# EasyEDA Pro project CH32V203C8T6采样整合板.eprj

# Board PCB
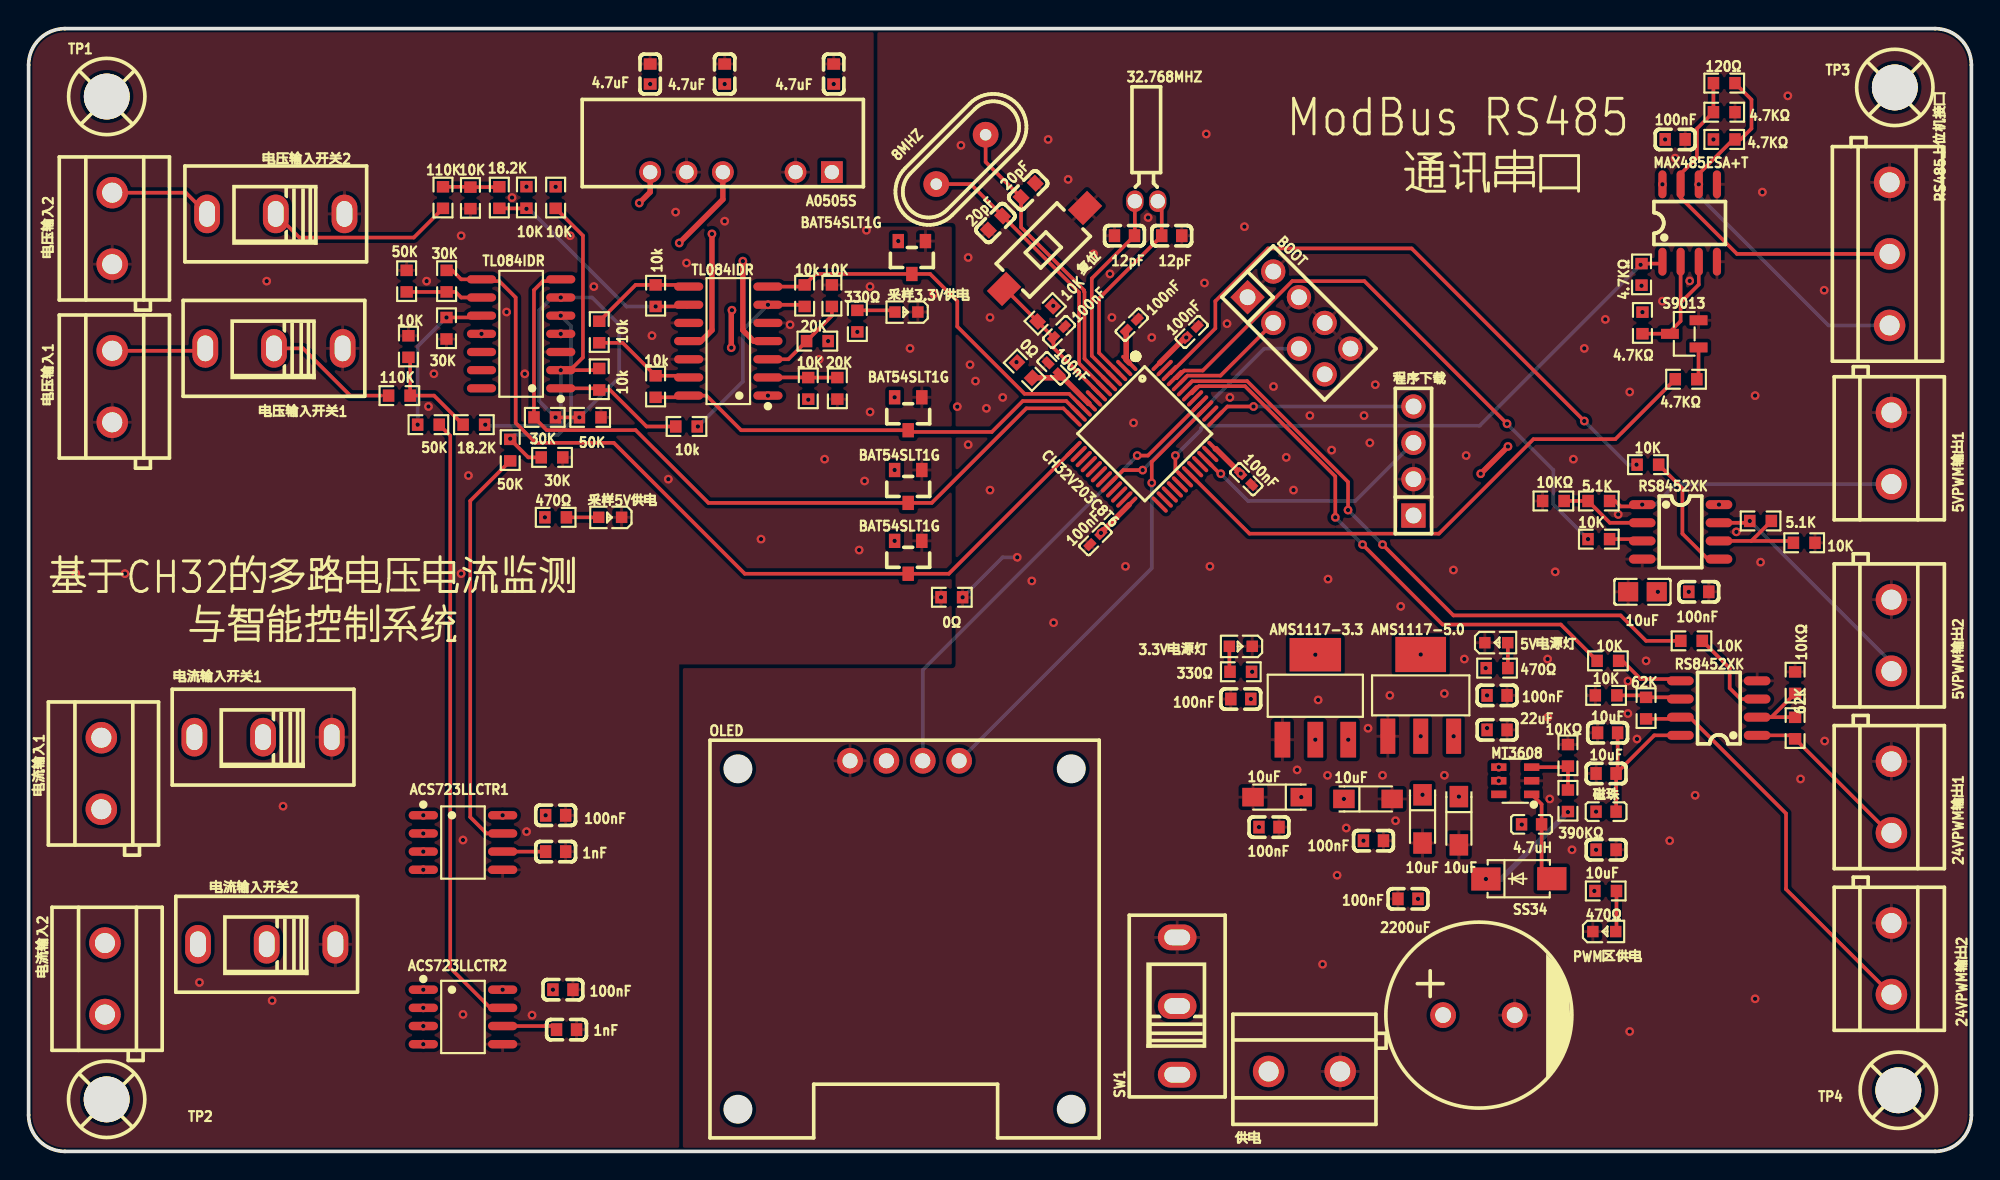
[diagram p0: board, top side]
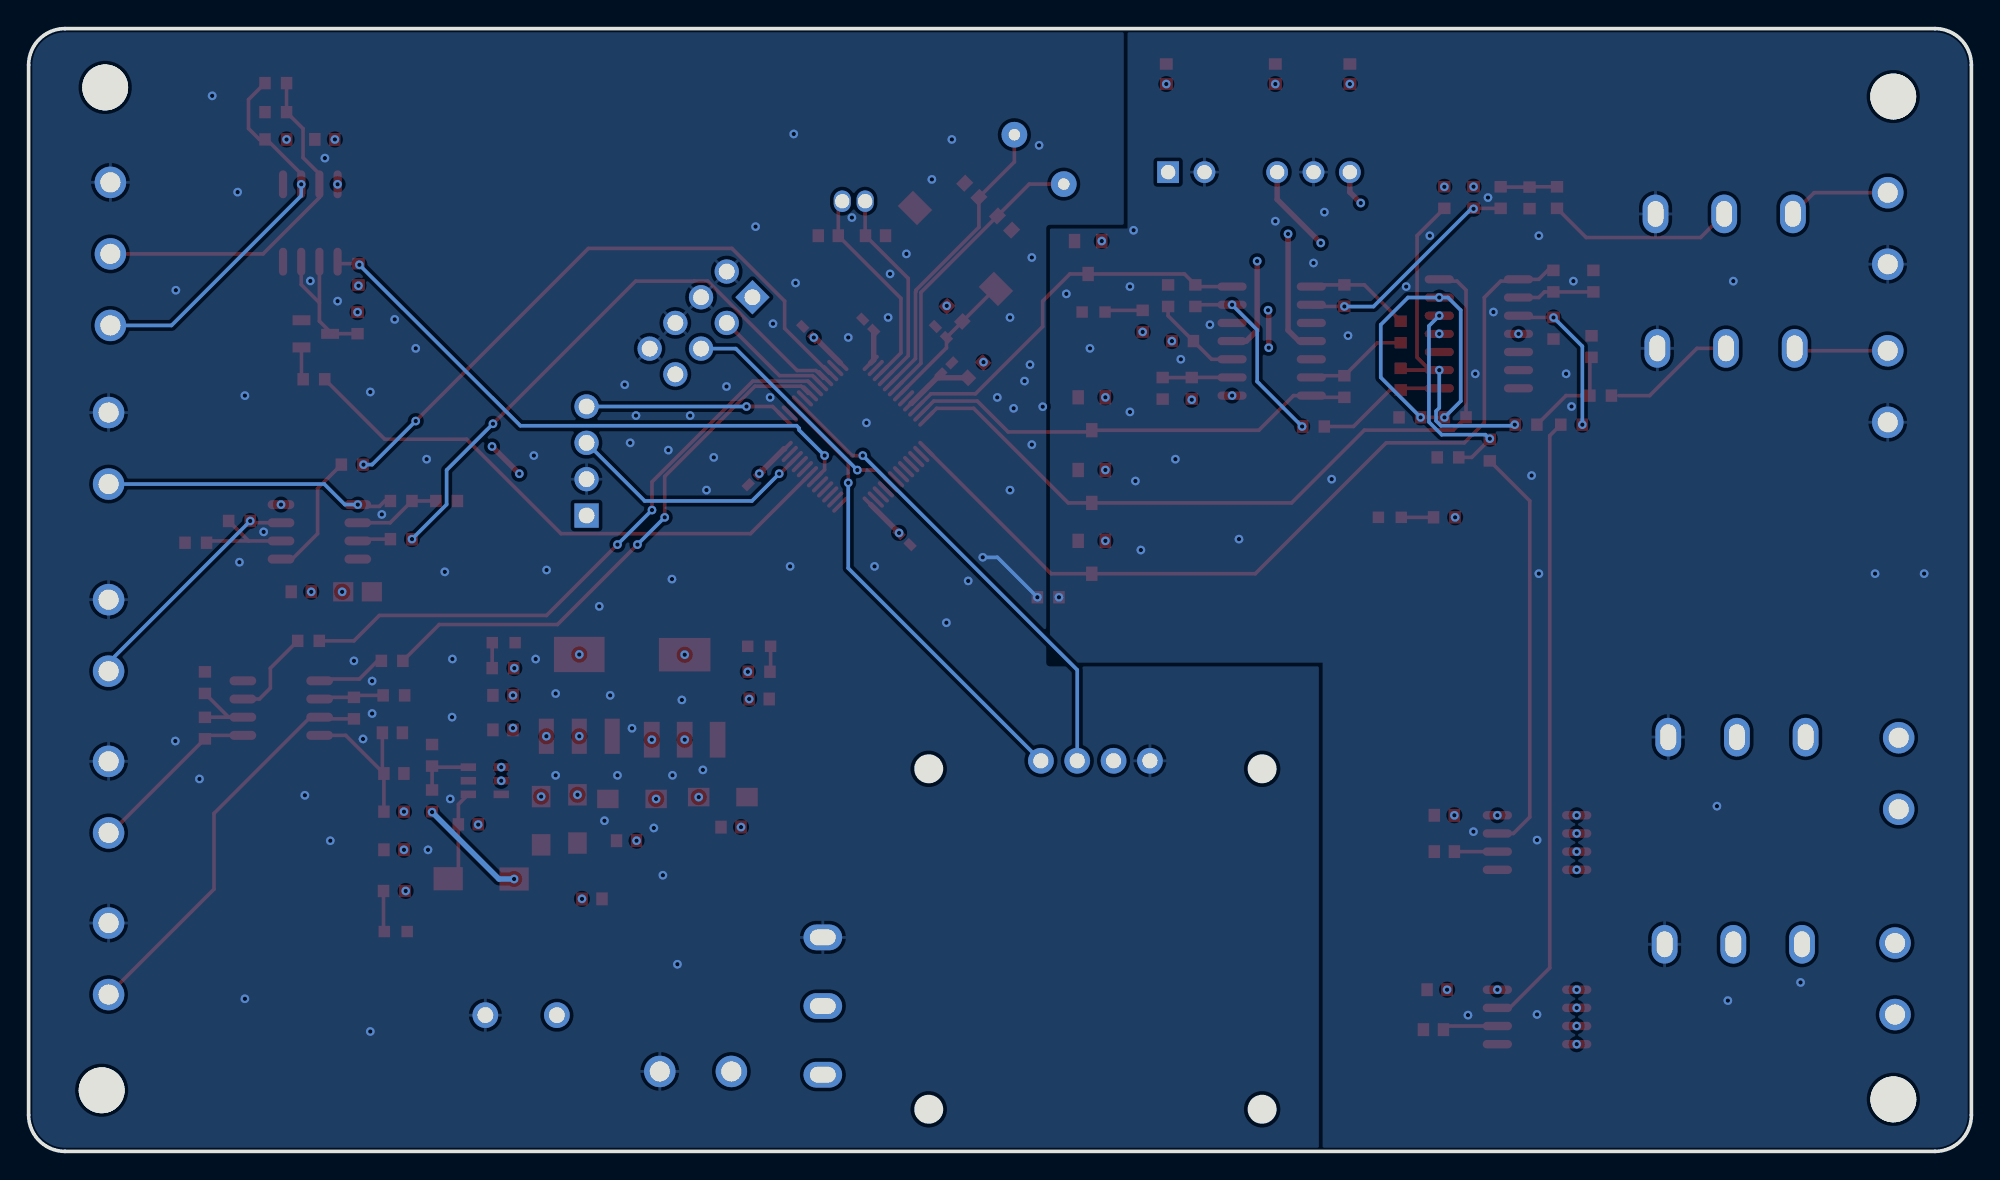
[diagram p1: board, bottom side, seen from below]

Outline 135.76 x 78.49 mm; copper layers: Top Layer, 电源层, GND, Bottom Layer. Coordinates in mm from the lower left corner of the outline.
Outline path: 0,75.95 0,2.54 arc(0.74,0.74) 2.54,0 133.22,0 arc(135.02,0.74) 135.76,2.54 135.76,75.95 arc(135.02,77.74) 133.22,78.49 2.54,78.49 arc(0.74,77.74) 0,75.95
Stack: Top Layer 0.035mm 外层铜厚1oz / Dielectric1 0.2104mm 7628 RC49% 8.6mil / 电源层 0.0152mm 内层铜厚 / Dielectric2 1.065mm 1.1mm H/HOZ Copper / GND 0.0152mm 内层铜厚 / Dielectric3 0.2104mm 7628 RC49% 8.6mil / Bottom Layer 0.035mm 外层铜厚1oz

## Design rules (mm)
template: JLCPCB Capability(Two Layers Board)
spacing copperThickness1oz (default): track to track 0.102, other pairs 0.152 to 0.3
spacing copperThickness2oz: track to track 0.203, other pairs 0.152 to 0.3
track width copperThickness1oz (default): min 0.127, default 0.254, max 2.54
track width copperThickness2oz: min 0.203, default 0.254, max 2.54
differential pair differentialPair (default): width min 0.127, default 0.254, max 2.54; gap min 0.152, default 0.152
via viaSize (default): diameter min 0.5, default 0.61, max 10; hole min 0.3, default 0.305, max 6.3

## Placement (name value [footprint] x y rotation side)
0Ω  -  [R0603]  69.6 54.61 315 top
0Ω#2  -  [R0603]  64.52 38.73 180 top
1nF  -  [C0603]  36.83 20.95 180 top
1nF#2  -  [C0603]  37.59 8.51 180 top
3.3V电源灯  LTST-C190KSKT  [LED0603-RD]  84.71 35.31 180 top
4.7KΩ  -  [R0603]  112.71 61.31 270 top
4.7KΩ#2  -  [R0603]  118.49 70.74 0 top
4.7KΩ#3  -  [R0603]  118.49 72.64 0 top
4.7KΩ#4  -  [R0603]  115.82 53.97 180 top
4.7KΩ#5  -  [R0603]  112.78 57.91 90 top
4.7uF  -  [C0603]  56.26 75.31 270 top
4.7uF#2  -  [C0603]  43.43 75.31 90 top
4.7uF#3  -  [C0603]  48.64 75.31 270 top
4.7uH  4.7uH  [L0603]  105.03 22.86 180 top
5.1K  -  [R0603]  109.73 45.47 0 top
5.1K#2  -  [R0603]  121.03 44.07 0 top
5VPWM输出1  KF301-5.0-2P  [CONN-TH_P5.00_KF301-5.0-2P]  130.17 49.15 90 top
5VPWM输出2  KF301-5.0-2P  [CONN-TH_P5.00_KF301-5.0-2P]  130.17 36.07 90 top
5V电源灯  LTST-C190KSKT  [LED0603-RD]  102.56 35.56 0 top
8MHZ  8MHz  [HC-49US_L11.0-W4.6-P4.88]  65.15 69.34 225 top
10K  -  [R0603]  109.73 42.8 0 top
10k  -  [R0603]  39.88 53.97 90 top
10K#2  -  [R0603]  113.16 48.01 180 top
10k#2  -  [R0603]  45.97 50.67 180 top
10K#3  -  [R0603]  124.08 42.55 180 top
10k#3  -  [R0603]  54.23 59.82 270 top
10K#4  -  [R0603]  116.2 35.69 0 top
10k#4  -  [R0603]  39.88 57.28 90 top
10K#5  -  [R0603]  110.36 34.29 180 top
10k#5  -  [R0603]  43.81 53.47 90 top
10K#6  -  [R0603]  110.24 31.88 0 top
10k#6  -  [R0603]  43.81 59.82 270 top
10K#7  -  [R0603]  56.13 59.82 90 top
10K#8  -  [R0603]  54.48 53.34 90 top
10K#9  -  [R0603]  26.54 56.26 90 top
10K#10  -  [R0603]  36.83 66.67 90 top
10K#11  -  [R0603]  30.88 66.65 270 top
10K#12  -  [R0603]  34.79 66.68 90 top
10K#13  -  [R0603]  71.04 58.55 225 top
10KΩ  -  [R0603]  106.55 45.47 0 top
10KΩ#2  -  [R0603]  107.57 27.69 270 top
10KΩ#3  -  [R0603]  123.44 32.77 270 top
10uF  -  [CAP-SMD_L3.2-W1.6-RD]  87.25 24.77 180 top
10uF#2  -  [CAP-SMD_L3.2-W1.6-RD]  93.6 24.64 0 top
10uF#3  -  [CAP-SMD_L3.2-W1.6-RD]  99.95 23.11 270 top
10uF#4  -  [CAP-SMD_L3.2-W1.6-RD]  97.41 23.24 270 top
10uF#5  -  [C0805]  112.78 39.12 0 top
10uF#6  -  [C0603]  110.34 29.26 0 top
10uF#7  -  [C0603]  110.24 26.42 0 top
10uF#8  -  [C0603]  110.24 21.08 0 top
12pF  -  [C0603]  79.88 64.01 180 top
12pF#2  -  [C0603]  76.58 64.01 0 top
18.2K  -  [R0603]  31.11 50.8 0 top
18.2K#2  -  [R0603]  32.89 66.67 270 top
20K  -  [R0603]  56.51 53.34 90 top
20K#2  -  [R0603]  55.12 56.64 180 top
20pF  -  [C0603]  69.85 67.18 225 top
20pF#2  -  [C0603]  67.56 64.9 45 top
22uF  22uF  [C0603]  102.62 29.46 180 top
24VPWM输出1  KF301-5.0-2P  [CONN-TH_P5.00_KF301-5.0-2P]  130.17 24.77 90 top
24VPWM输出2  KF301-5.0-2P  [CONN-TH_P5.00_KF301-5.0-2P]  130.17 13.46 90 top
30K  -  [R0603]  36.58 48.51 180 top
30K#2  -  [R0603]  36.07 51.31 0 top
30K#3  -  [R0603]  29.2 57.54 90 top
30K#4  -  [R0603]  29.21 60.83 270 top
32.768MHZ  32.768kHz  [OSC-TH_BD2.0-P0.50]  78.1 66.42 0 top
50K  -  [R0603]  39.24 51.31 180 top
50K#2  -  [R0603]  33.66 49.02 90 top
50K#3  -  [R0603]  26.42 60.83 270 top
50K#4  -  [R0603]  27.94 50.8 180 top
62K  -  [R0603]  123.44 29.59 270 top
62K#2  -  [R0603]  113.03 30.99 90 top
100nF  -  [C0402]  77.09 57.78 225 top
100nF#2  -  [C0402]  71.63 54.74 315 top
100nF#3  -  [C0402]  85.09 46.99 315 top
100nF#4  -  [C0402]  74.55 42.8 45 top
100nF#5  -  [C0402]  81.28 57.28 45 top
100nF#6  -  [C0402]  72.01 57.28 45 top
100nF#7  -  [C0603]  36.83 23.49 180 top
100nF#8  -  [C0603]  37.34 11.3 180 top
100nF#9  -  [C0603]  115.06 70.74 0 top
100nF#10  -  [C0603]  86.68 22.67 180 top
100nF#11  -  [C0603]  84.71 31.62 0 top
100nF#12  -  [C0603]  93.98 21.72 180 top
100nF#13  -  [C0603]  102.62 31.88 180 top
100nF#14  -  [C0603]  116.71 39.12 180 top
100nF#15  -  [C0603]  96.39 17.65 0 top
110K  -  [R0603]  25.91 52.83 0 top
110K#2  -  [R0603]  28.96 66.67 90 top
120Ω  120Ω  [R0603]  118.49 74.68 180 top
330Ω  -  [R0603]  84.71 33.53 180 top
330Ω#2  -  [R0603]  57.91 58.04 270 top
390KΩ  390kΩ  [R0603]  107.57 24.51 270 top
470Ω  -  [R0603]  102.62 33.78 0 top
470Ω#2  -  [R0603]  36.83 44.32 180 top
470Ω#3  -  [R0603]  110.21 18.2 180 top
2200uF  2200uF  [CAP-TH_BD13.0-P5.00-D0.6-FD]  101.35 9.53 0 top
A0505S  A0505S-1WR3  [PWRM-TH_5P-L19.7-W6.0-P2.54_DEXU_A0515S-1WR3]  49.78 68.45 180 top
ACS723LLCTR1  ACS723LLCTR-05AB-T  [SOIC-8_L4.9-W3.9-P1.27-LS6.0-BL]  30.35 21.59 270 top
ACS723LLCTR2  ACS723LLCTR-05AB-T  [SOIC-8_L4.9-W3.9-P1.27-LS6.0-BL]  30.35 9.4 270 top
AMS1117-3.3  AMS1117-3.3  [SOT-223-3_L6.5-W3.4-P2.30-LS7.0-BR]  89.92 31.75 270 top
AMS1117-5.0  AMS1117-5.0  [SOT-223_L6.5-W3.5-P2.30-LS7.0-BR]  97.28 31.88 270 top
BAT54SLT1G  -  [SOT-23_L2.9-W1.3-P1.90-LS2.4-BR]  61.72 62.48 90 top
BAT54SLT1G#2  -  [SOT-23_L2.9-W1.3-P1.90-LS2.4-BR]  61.47 51.56 90 top
BAT54SLT1G#3  -  [SOT-23_L2.9-W1.3-P1.90-LS2.4-BR]  61.47 46.48 90 top
BAT54SLT1G#4  -  [SOT-23_L2.9-W1.3-P1.90-LS2.4-BR]  61.47 41.53 90 top
BOOT  PZ254V-12-8P  [HDR-TH_8P-P2.54-V-M-R2-C4-S2.54]  88.77 57.91 315 top
CH32V203C8T6  CH32V203C8T6  [LQFP-48_L7.0-W7.0-P0.50-LS9.0-BL]  77.98 50.16 225 top
MAX485ESA+T  MAX485ESA+T  [SOIC-8_L5.0-W4.0-P1.27-LS6.0-BL]  116.08 64.9 0 top
MT3608  MT3608  [SOT-23-6_L2.9-W1.6-P0.95-LS2.8-BL]  103.89 25.91 90 top
OLED  HS96L03W2C03  [OLED-TH_L27.8-W27.2-P2.54_C9900033791]  61.21 27.3 0 top
PWM区供电  LTST-C190KSKT  [LED0603-RD]  110.11 15.37 0 top
RS485上位机接口  KF301-5.0-3P  [CONN-TH_3P-P5.00_KF301-5.0-3P]  130.05 62.74 90 top
RS8452XK  -  [SOP-8_L4.9-W3.9-P1.27-LS6.0-BL]  115.44 43.31 270 top
RS8452XK#2  -  [SOP-8_L4.9-W3.9-P1.27-LS6.0-BL]  118.11 30.99 90 top
S9013  S9013 J3(RANGE:200-350)  [SOT-23-3_L2.9-W1.3-P1.90-LS2.4-BR]  115.7 57.15 0 top
SS34  SS34  [SMA_L4.3-W2.6-LS5.0-FD]  104.14 19.05 180 top
SW1  SS-12D10G6-G  [SW-TH_SS-12D10G4-G]  80.26 10.16 90 top
TL084IDR  -  [SOIC-14_L8.7-W3.9-P1.27-LS6.0-BL]  48.89 56.64 90 top
TL084IDR#2  -  [SOIC-14_L8.7-W3.9-P1.27-LS6.0-BL]  34.42 57.15 90 top
TP1  -  [M3螺丝]  5.52 73.68 0 top
TP2  -  [M3螺丝]  5.52 3.57 0 top
TP3  -  [M3螺丝]  130.48 74.31 0 top
TP4  -  [M3螺丝]  130.72 4.21 0 top
供电  KF301-5.0-2P  [CONN-TH_P5.00_KF301-5.0-2P]  89.15 5.59 0 top
复位  TS-1101-C-W  [SW-SMD_L6.0-W3.3-LS8.0]  70.99 63.12 45 top
电压输入1  KF301-5.0-2P  [CONN-TH_P5.00_KF301-5.0-2P]  5.84 53.47 270 top
电压输入2  KF301-5.0-2P  [CONN-TH_P5.00_KF301-5.0-2P]  5.84 64.52 270 top
电压输入开关1  SS-12D10G6-G  [SW-TH_SS-12D10G4-G]  17.14 56.13 180 top
电压输入开关2  SS-12D10G6-G  [SW-TH_SS-12D10G4-G]  17.27 65.53 180 top
电流输入1  KF301-5.0-2P  [CONN-TH_P5.00_KF301-5.0-2P]  5.08 26.42 270 top
电流输入2  KF301-5.0-2P  [CONN-TH_P5.00_KF301-5.0-2P]  5.33 12.06 270 top
电流输入开关1  SS-12D10G6-G  [SW-TH_SS-12D10G4-G]  16.38 28.96 180 top
电流输入开关2  SS-12D10G6-G  [SW-TH_SS-12D10G4-G]  16.64 14.48 180 top
磁珠  GZ1608D601TF  [L0603]  110.24 23.75 180 top
程序下载  PZ254V-11-04P  [HDR-TH_4P-P2.54-V-M]  96.77 48.26 90 top
采样3.3V供电  LTST-C190KSKT  [LED0603-RD]  61.34 58.67 180 top
采样5V供电  LTST-C190KSKT  [LED0603-RD]  40.64 44.32 180 top

## Footprints (pads in the part's own frame, mm; a bottom-side part is the same pattern mirrored in y, then rotated)
C0402
  rect 0.79x0.54 smd: 1(-0.545,0) 2(0.545,0)
C0603
  rect 0.8x0.9 smd: 1(-0.7,0) 2(0.7,0)
C0805
  rect 1.41x1.35 smd: 1(-1,0) 2(1,0)
CAP-SMD_L3.2-W1.6-RD
  rect 1.5x1.296 smd: 1(-1.687,0) 2(1.687,0)
CAP-TH_BD13.0-P5.00-D0.6-FD
  round 1.8 hole 1.1: 1(-2.5,0) 2(2.5,0)
CONN-TH_3P-P5.00_KF301-5.0-3P
  round 2.2 hole 1.4: 1(-5,0) 2(0,0) 3(5,0)
CONN-TH_P5.00_KF301-5.0-2P
  round 2.2 hole 1.4: 1(-2.5,0) 2(2.5,0)
HC-49US_L11.0-W4.6-P4.88
  round 1.8 hole 0.8: 1(-2.44,0) 2(2.44,0)
HDR-TH_4P-P2.54-V-M
  rect 1.7x1.7 hole 1.1: 1(-3.81,0)
  round 1.7 hole 1.1: 2(-1.27,0) 3(1.27,0) 4(3.81,0)
HDR-TH_8P-P2.54-V-M-R2-C4-S2.54
  rect 1.7x1.7 hole 1.1: 1(-3.81,-1.27)
  round 1.7 hole 1.1: 2(-3.81,1.27) 3(-1.27,-1.27) 4(-1.27,1.27) 5(1.27,-1.27) 6(1.27,1.27) 7(3.81,-1.27) 8(3.81,1.27)
L0603
  rect 0.8x0.864 smd: 1(-0.7,0) 2(0.7,0)
LED0603-RD
  rect 0.8x0.8 smd: 1(-0.799,0) 2(0.799,0)
LQFP-48_L7.0-W7.0-P0.50-LS9.0-BL
  oval 0.27x1.5 smd: 1(-2.75,-4.25) 2(-2.25,-4.25) 3(-1.75,-4.25) 4(-1.25,-4.25) 5(-0.75,-4.25) 6(-0.25,-4.25) 7(0.25,-4.25) 8(0.75,-4.25) 9(1.25,-4.25) 10(1.75,-4.25) 11(2.25,-4.25) 12(2.75,-4.25) 25(2.75,4.25) 26(2.25,4.25) 27(1.75,4.25) 28(1.25,4.25) 29(0.75,4.25) 30(0.25,4.25) 31(-0.25,4.25) 32(-0.75,4.25) 33(-1.25,4.25) 34(-1.75,4.25) 35(-2.25,4.25) 36(-2.75,4.25)
  oval 1.5x0.27 smd: 13(4.25,-2.75) 14(4.25,-2.25) 15(4.25,-1.75) 16(4.25,-1.25) 17(4.25,-0.75) 18(4.25,-0.25) 19(4.25,0.25) 20(4.25,0.75) 21(4.25,1.25) 22(4.25,1.75) 23(4.25,2.25) 24(4.25,2.75) 37(-4.25,2.75) 38(-4.25,2.25) 39(-4.25,1.75) 40(-4.25,1.25) 41(-4.25,0.75) 42(-4.25,0.25) 43(-4.25,-0.25) 44(-4.25,-0.75) 45(-4.25,-1.25) 46(-4.25,-1.75) 47(-4.25,-2.25) 48(-4.25,-2.75)
M3螺丝
  round 3.2 hole 3.2: 1(-0.064,0.064)
OLED-TH_L27.8-W27.2-P2.54_C9900033791
  round 1.8 hole 1.05: 1(-3.81,0) 2(-1.27,0) 3(1.27,0) 4(3.81,0)
OSC-TH_BD2.0-P0.50
  oval 1.2x1.5 hole 1: 1(-0.8,0) 2(0.8,0)
PWRM-TH_5P-L19.7-W6.0-P2.54_DEXU_A0515S-1WR3
  rect 1.524x1.524 hole 1: 1(-6.35,0)
  round 1.524 hole 1: 2(-3.81,0) 4(1.27,0) 5(3.81,0) 6(6.35,0)
R0603
  rect 0.806x0.864 smd: 1(-0.753,0) 2(0.753,0)
SMA_L4.3-W2.6-LS5.0-FD
  rect 2.046x1.62 smd: 1(-2.304,-0.009) 2(2.304,0.009)
SOIC-8_L4.9-W3.9-P1.27-LS6.0-BL
  oval 0.588x2.045 smd: 1(-1.905,-2.772) 2(-0.635,-2.772) 3(0.635,-2.772) 4(1.905,-2.772) 5(1.905,2.772) 6(0.635,2.772) 7(-0.635,2.772) 8(-1.905,2.772)
SOIC-8_L5.0-W4.0-P1.27-LS6.0-BL
  oval 0.569x1.95 smd: 1(-1.905,-2.705) 2(-0.635,-2.705) 3(0.635,-2.705) 4(1.905,-2.705) 5(1.905,2.705) 6(0.635,2.705) 7(-0.635,2.705) 8(-1.905,2.705)
SOIC-14_L8.7-W3.9-P1.27-LS6.0-BL
  oval 0.574x2.038 smd: 1(-3.81,-2.769) 2(-2.54,-2.769) 3(-1.27,-2.769) 4(0,-2.769) 5(1.27,-2.769) 6(2.54,-2.769) 7(3.81,-2.769) 8(3.81,2.769) 9(2.54,2.769) 10(1.27,2.769) 11(0,2.769) 12(-1.27,2.769) 13(-2.54,2.769) 14(-3.81,2.769)
SOP-8_L4.9-W3.9-P1.27-LS6.0-BL
  oval 0.63x1.865 smd: 1(-1.905,-2.683) 2(-0.635,-2.683) 3(0.635,-2.683) 4(1.905,-2.683) 5(1.905,2.683) 6(0.635,2.683) 7(-0.635,2.683) 8(-1.905,2.683)
SOT-23-3_L2.9-W1.3-P1.90-LS2.4-BR
  rect 1.25x0.7 smd: 1(1,-0.95) 2(1,0.95) 3(-1,0)
SOT-23-6_L2.9-W1.6-P0.95-LS2.8-BL
  rect 0.532x1.072 smd: 1(-0.95,-1.149) 2(0,-1.149) 3(0.95,-1.149) 4(0.95,1.149) 5(0,1.149) 6(-0.95,1.149)
SOT-23_L2.9-W1.3-P1.90-LS2.4-BR
  rect 1x0.8 smd: 1(1.15,-0.95) 2(1.15,0.95) 3(-1.15,0)
SOT-223-3_L6.5-W3.4-P2.30-LS7.0-BR
  rect 2.5x1.1 smd: 1(2.97,-2.3) 2(2.97,0) 3(2.97,2.3)
  rect 2.34x3.6 smd: 4(-2.97,0)
SOT-223_L6.5-W3.5-P2.30-LS7.0-BR
  rect 2.465x1.05 smd: 1(2.857,-2.3) 2(2.857,0) 3(2.857,2.3)
  rect 2.465x3.54 smd: 4(-2.857,0)
SW-SMD_L6.0-W3.3-LS8.0
  rect 1.9x1.5 smd: 1(-4,0) 2(4,0)
SW-TH_SS-12D10G4-G
  oval 1.8x2.7 hole 1.1x1.8: 1(-4.8,0) 2(-0.001,0) 3(4.8,0)

## Nets
5V: 4.7uF#3.2 A0505S.4 TL084IDR.4 TL084IDR#2.4
+1.65V: 10K#8.1 10K#10.2 10K#12.2 TL084IDR.1
+5V: 4.7uF.2 4.7uH.2 10uF#4.1 10uF#5.2 22uF.2 100nF#7.2 100nF#8.2 100nF#13.2 100nF#14.2 470Ω.1 470Ω#2.2 470Ω#3.2 A0505S.1 ACS723LLCTR1.8 ACS723LLCTR2.8 AMS1117-5.0.2 AMS1117-5.0.4 MT3608.4 MT3608.5 RS8452XK.8
+24V: 10uF#8.1 100nF#15.2 390KΩ.2 2200uF.1 SS34.2 磁珠.2
-5V: 4.7uF#2.1 A0505S.6 TL084IDR.11 TL084IDR#2.11
AGND: 0Ω#2.2 1nF.1 1nF#2.1 4.7uF.1 4.7uF#2.2 4.7uF#3.1 10K#7.2 10K#9.2 10K#11.2 20K.1 30K.1 30K#3.1 50K.1 50K#3.1 100nF#7.1 100nF#8.1 A0505S.2 A0505S.5 ACS723LLCTR1.5 ACS723LLCTR2.5 BAT54SLT1G.1 BAT54SLT1G#2.1 BAT54SLT1G#3.1 BAT54SLT1G#4.1 TL084IDR.5 TL084IDR.10 TL084IDR.12 TL084IDR#2.3 电压输入1.2 电压输入2.2 电压输入开关1.1 电压输入开关2.1 电流输入开关1.1 电流输入开关2.1 采样3.3V供电.1 采样5V供电.1
GND: 0Ω#2.1 3.3V电源灯.1 4.7KΩ#3.2 5VPWM输出1.2 5VPWM输出2.2 5V电源灯.1 10K#3.1 10K#6.1 10KΩ.1 10KΩ#2.1 10KΩ#3.1 10uF.2 10uF#2.2 10uF#3.2 10uF#4.2 10uF#5.1 10uF#6.1 10uF#7.1 10uF#8.2 12pF.1 12pF#2.1 20pF.1 20pF#2.1 22uF.1 24VPWM输出1.2 24VPWM输出2.2 100nF.1 100nF#2.1 100nF#3.2 100nF#4.1 100nF#5.2 100nF#6.2 100nF#9.2 100nF#10.1 100nF#11.1 100nF#12.1 100nF#13.1 100nF#14.1 100nF#15.1 2200uF.2 AMS1117-3.3.1 AMS1117-5.0.1 BOOT.2 BOOT.4 BOOT.6 BOOT.8 CH32V203C8T6.8 CH32V203C8T6.23 CH32V203C8T6.35 CH32V203C8T6.47 MAX485ESA+T.4 MAX485ESA+T.5 MT3608.2 OLED.1 PWM区供电.1 RS485上位机接口.3 RS8452XK.4 RS8452XK#2.4 S9013.2 SW1.3 供电.2 复位.2 程序下载.2
VCC: 0Ω.1 4.7KΩ.2 4.7KΩ#2.1 4.7KΩ#5.2 10K#13.1 10uF.1 20K#2.1 100nF#3.1 100nF#4.2 100nF#5.1 100nF#9.1 100nF#11.2 330Ω.1 330Ω#2.2 AMS1117-3.3.2 AMS1117-3.3.4 BAT54SLT1G.2 BAT54SLT1G#2.2 BAT54SLT1G#3.2 BAT54SLT1G#4.2 BOOT.1 BOOT.7 CH32V203C8T6.24 CH32V203C8T6.36 CH32V203C8T6.48 MAX485ESA+T.8 OLED.2 程序下载.1
VIN: 10uF#2.1 10uF#3.1 100nF#10.2 100nF#12.2 AMS1117-3.3.3 AMS1117-5.0.3 SW1.2
VIN1: 电压输入1.1 电压输入开关1.3
VIN2: 电压输入2.1 电压输入开关2.3
BOOT0: BOOT.3 CH32V203C8T6.44
BOOT1: BOOT.5 CH32V203C8T6.20
IIN1: 电流输入1.1 电流输入开关1.3
IIN1-: ACS723LLCTR1.3 ACS723LLCTR1.4 电流输入1.2
IIN2: 电流输入2.1 电流输入开关2.3
IIN2-: ACS723LLCTR2.3 ACS723LLCTR2.4 电流输入2.2
NRST: 10K#13.2 100nF#6.1 CH32V203C8T6.7 复位.1
PA0: 10k#3.1 BAT54SLT1G.3 CH32V203C8T6.10 TL084IDR.7
PA1: 10k#5.1 BAT54SLT1G#2.3 CH32V203C8T6.11 TL084IDR.14
PA2: 30K#2.1 BAT54SLT1G#3.3 CH32V203C8T6.12 TL084IDR#2.7
PA3: 30K#4.1 BAT54SLT1G#4.3 CH32V203C8T6.13 TL084IDR#2.8
PB3: CH32V203C8T6.39 OLED.4
PB4: CH32V203C8T6.40 OLED.3
PB6: 10K#5.2 CH32V203C8T6.42
PB7: 10K#4.1 CH32V203C8T6.43
PB8: 10K.1 CH32V203C8T6.45
PB9: 10K#2.2 CH32V203C8T6.46
PC14: 12pF.2 32.768MHZ.2 CH32V203C8T6.3
PC15: 12pF#2.2 32.768MHZ.1 CH32V203C8T6.4
PD0: 8MHZ.2 20pF#2.2 CH32V203C8T6.6
PD1: 8MHZ.1 20pF.2 CH32V203C8T6.5
PWM_OUT1: 5.1K.2 5VPWM输出1.1 RS8452XK.1
PWM_OUT2: 5.1K#2.1 5VPWM输出2.1 RS8452XK.7
PWM_OUT3: 24VPWM输出1.1 62K.2 RS8452XK#2.1
PWM_OUT4: 24VPWM输出2.1 62K#2.1 RS8452XK#2.7
RS485A: 4.7KΩ#2.2 120Ω.1 MAX485ESA+T.6 RS485上位机接口.1
RS485B: 4.7KΩ#3.1 120Ω.2 MAX485ESA+T.7 RS485上位机接口.2
SWCLK: CH32V203C8T6.37 程序下载.4
SWDIO: CH32V203C8T6.34 程序下载.3
UARTRX: 4.7KΩ.1 CH32V203C8T6.30 MAX485ESA+T.1
UARTTX: 4.7KΩ#4.2 CH32V203C8T6.31
$1N657: 0Ω.2 100nF#2.2 CH32V203C8T6.9
$1N671: 100nF.2 CH32V203C8T6.1
$1N1522: 4.7KΩ#4.1 S9013.1
$1N1526: 4.7KΩ#5.1 MAX485ESA+T.2 MAX485ESA+T.3 S9013.3
$1N2736: SW1.1 供电.1
$1N3426: 3.3V电源灯.2 330Ω.2
$1N3897: 5V电源灯.2 470Ω.2
$1N5125: 5.1K.1 10KΩ.2 RS8452XK.2
$1N5128: 10K.2 RS8452XK.3
$1N5140: 5.1K#2.2 10K#3.2 RS8452XK.6
$1N5275: 10K#2.1 RS8452XK.5
$1N6201: 4.7uH.1 MT3608.1 SS34.1
$1N6386: 10KΩ#2.2 390KΩ.1 MT3608.3
$1N7527: 10KΩ#3.2 62K.1 RS8452XK#2.2
$1N7530: 10K#4.2 RS8452XK#2.3
$1N7544: 10K#6.2 62K#2.2 RS8452XK#2.6
$1N7545: 10K#5.1 RS8452XK#2.5
$1N7868: 10uF#6.2 10uF#7.2 RS8452XK#2.8 磁珠.1
$1N9305: 10K#7.1 20K#2.2 TL084IDR.3
$1N9307: 10K#8.2 20K.2 TL084IDR.2
$1N9531: 330Ω#2.1 采样3.3V供电.2
$1N9532: 470Ω#2.1 采样5V供电.2
$1N9631: 470Ω#3.1 PWM区供电.2
$1N10550: 110K.1 电压输入开关1.2
$1N10551: 10K#9.1 18.2K.1 110K.2
$1N10553: 10k.2 10K#10.1 18.2K.2 TL084IDR#2.2
$1N10555: 10k.1 10k#2.2 TL084IDR#2.1
$1N10556: 10k#2.1 10k#3.2 TL084IDR.6
$1N10559: 110K#2.1 电压输入开关2.2
$1N10560: 10K#11.1 18.2K#2.1 110K#2.2
$1N10562: 10k#6.2 10K#12.1 18.2K#2.2 TL084IDR.9
$1N10563: 10k#4.2 10k#6.1 TL084IDR.8
$1N10564: 10k#4.1 10k#5.2 TL084IDR.13
$1N11472: ACS723LLCTR1.1 ACS723LLCTR1.2 电流输入开关1.2
$1N11473: 1nF.2 ACS723LLCTR1.6
$1N11480: ACS723LLCTR2.1 ACS723LLCTR2.2 电流输入开关2.2
$1N11481: 1nF#2.2 ACS723LLCTR2.6
$1N11486: 50K#2.1 ACS723LLCTR1.7
$1N11487: 30K#2.2 50K.2 TL084IDR#2.6
$1N11488: 30K.2 50K#2.2 TL084IDR#2.5
$1N11493: 50K#4.1 ACS723LLCTR2.7
$1N11494: 30K#4.2 50K#3.2 TL084IDR#2.9
$1N11495: 30K#3.2 50K#4.2 TL084IDR#2.10

Pads without a net: CH32V203C8T6 2 14 15 16 17 18 19 21 22 25 26 27 28 29 32 33 38 41; MT3608 6; TL084IDR#2 12 13 14; TP1 1; TP2 1; TP3 1; TP4 1

## Via types
v1: diameter 0.61, hole 0.305, Top Layer to Bottom Layer, 227 vias

## Routing (per net, layer and track width the routed paths; a pad name or vN(x,y) marks a point on that pad's centre or on a via; arc(x,y) is an arc through that point)
5V: length 37
  Top Layer w0.381: A0505S.4 48.51,66.55 v1(45.47,63.5) ; v1(49.91,62.23) 49.91,57.4 50.67,56.64 TL084IDR.4
  电源层 w0.381: v1(37.19,57.15) 39.12,57.15 v1(45.47,63.5) ; v1(49.91,62.23) 49.91,67.06 A0505S.4 48.64,68.58 v1(48.64,74.61)
+1.65V: length 29.6
  Top Layer w0.381: v1(49.1,56.18) 49.1,58.75 v1(49.15,58.8)
  电源层 w0.381: v1(49.1,56.18) 49.1,54.4 50.67,52.83 v1(51.66,52.83) 54.2,52.83 v1(54.48,52.55) ; v1(49.15,58.8) 49.15,60.73 42.45,67.43 v1(36.83,67.43) 36.82,67.44 v1(34.79,67.44)
+5V: length 215.6
  电源层 w0.381: 56.26,68.58 A0505S.1 56.13,64.64 36.08,44.59 v1(36.08,44.32) 36.08,35.57 33.13,32.62 33.13,30.35 ; 56.26,68.58 58.17,68.58 60.07,70.48 62.31,70.48 63.46,69.34 83.57,69.34 102.36,50.55 102.36,39.81 v1(97.28,34.73) v1(97.28,29.02) ; 56.26,68.58 v1(56.26,74.61) ; 33.13,30.35 v1(33.13,23.49) v1(33.13,11.3) v1(36.64,11.3) ; 33.13,30.35 36.13,27.34 v1(36.13,23.49) ; v1(101.92,31.88) v1(101.92,29.59) 102.74,28.77 v1(102.74,26.86) v1(102.74,25.91) 104.34,24.3 v1(104.34,22.84) 108.98,18.2 v1(109.41,18.2) ; v1(101.92,31.88) 100.14,31.88 v1(97.28,29.02) ; v1(101.92,31.88) 101.82,31.97 v1(101.82,33.78) 105.12,37.08 111.82,37.08 v1(113.85,39.12) v1(116.01,39.12) 116.84,39.94 116.84,43.93 v1(118.13,45.21) ; v1(97.28,29.02) 97.41,28.89 v1(97.41,24.93)
+24V: length 26.5
  电源层 w0.381: 2200uF.1 97.09,11.28 v1(97.09,17.65) 98.48,19.04 v1(101.84,19.04) ; v1(107.57,23.72) 109.5,23.72 v1(109.54,23.75) v1(109.54,21.08)
  Bottom Layer w0.381: v1(107.57,23.72) 102.89,19.04 v1(101.84,19.04)
-5V: length 38.2
  Top Layer w0.381: v1(47.75,64.13) 47.75,57.4 46.99,56.64 TL084IDR.11 ; A0505S.6 43.43,67.06 v1(42.67,66.29)
  电源层 w0.381: v1(43.43,74.61) A0505S.6 v1(47.75,64.13) ; v1(42.67,66.29) 33.53,57.15 v1(31.65,57.15)
AGND:
  vias: v1(3.3,40.39) v1(6.73,40.39) v1(11.94,11.81) v1(16.64,60.83) v1(17.02,10.54) v1(17.78,24.13) v1(27.81,60.83) v1(27.94,52.07) v1(28.32,54.36) v1(30.23,64.01) v1(30.23,40.39) v1(30.35,21.76) v1(30.35,9.57) v1(30.73,47.24) v1(33.4,58.67) v1(33.78,66.67) v1(34.67,54.36) v1(34.8,22.35) v1(35.18,9.53) v1(37.85,64.01) v1(39.5,60.45) v1(43.56,57.02) v1(44.7,46.99) v1(45.21,65.66) v1(45.97,62.1) v1(48.64,65.02) v1(51.18,42.8) v1(53.21,57.78) v1(55.25,55.37) v1(55.63,48.39) v1(58.04,42.04) v1(58.42,46.86) v1(58.55,64.39) v1(58.8,60.45) v1(58.8,51.69) v1(61.59,56.13) v1(63.25,59.94) v1(63.76,38.73)
GND: length 5
  Bottom Layer w0.254: v1(69.09,41.53) 68.06,41.53 v1(65.27,38.73)
  vias: v1(64.9,52.06) v1(65.15,70.33) v1(65.66,62.48) v1(65.66,49.4) v1(65.79,54.99) v1(66.17,53.85) v1(66.93,51.94) v1(67.18,58.29) v1(67.18,46.23) v1(68.07,52.7) v1(70.1,39.88) v1(71.25,70.74) v1(71.63,36.96) v1(72.64,67.94) v1(74.42,62.74) v1(75.56,61.34) v1(75.7,58.3) v1(76.65,40.89) v1(77.22,50.93) v1(78.23,65.28) v1(78.49,56.9) v1(82.17,60.71) v1(82.3,71.12) v1(82.55,40.89) v1(83.75,57.86) v1(83.95,52.7) v1(84.96,64.64) v1(87,53.47) v1(87.88,48.51) v1(88.39,46.23) v1(88.65,26.67) v1(89.53,51.44) v1(90.11,31.56) v1(90.42,13.08) v1(90.81,40) v1(90.77,26.29) v1(91.06,49.02) v1(91.44,19.3) v1(92.07,22.61) v1(93.32,51.44) v1(93.6,29.58) v1(93.73,49.53) v1(94.11,53.59) v1(94.62,26.29) v1(95.12,31.88) v1(95.52,23.11) v1(95.88,38.1) v1(98.93,32) v1(98.93,26.29) v1(99.57,40.64) v1(100.33,34.42) v1(100.46,48.64) v1(106.15,34.42) v1(106.17,30.35) v1(106.3,24.64) v1(106.68,40.51) v1(107.85,21.08) v1(107.95,48.39) v1(108.71,56.13) v1(110.18,58.16) v1(111.08,44.53) v1(111.76,32.88) v1(111.76,30.61) v1(111.89,53.09) v1(111.89,8.38) v1(112.39,28.83) v1(113.03,34.29) v1(114.17,59.44) v1(114.68,21.72) v1(115.06,69.43) v1(116.08,60.85) v1(116.46,24.89) v1(119.34,43.31) v1(120.65,52.83) v1(120.65,10.67) v1(121.03,41.19) v1(121.16,67.06) v1(122.94,73.79) v1(123.82,26.03) v1(125.48,60.2) v1(125.51,28.69)
VCC: length 203.1
  Top Layer w0.381: CH32V203C8T6.48 80.82,56.89 v1(80.89,56.89) ; CH32V203C8T6.24 v1(74.93,43.23) 100nF#4.2 ; v1(103.38,49.28) v1(101.47,47.37) ; v1(84.7,47.38) 82.98,49.1 CH32V203C8T6.36
  电源层 w0.381: 84.7,53.08 84.7,59.23 BOOT.1 ; 84.7,53.08 v1(84.7,47.38) ; 84.7,53.08 v1(80.89,56.89) 78.68,59.11 v1(71.6,59.11) 69.03,56.54 v1(69.03,55.17) 66.57,52.7 ; v1(60.52,42.68) v1(60.52,47.63) 60.52,47.94 62.23,49.66 63.52,49.66 66.57,52.7 ; v1(103.38,49.28) 103.39,49.28 v1(112.78,58.67) 112.78,60.45 v1(112.71,60.51) 114.17,61.97 v1(114.17,67.6) 113.92,67.86 113.92,70.3 v1(114.36,70.74) v1(117.74,70.74) ; 66.57,52.7 60.53,52.7 v1(60.52,52.71) 57.91,55.32 v1(57.91,57.29) ; OLED.2 59.94,28.24 v1(74.93,43.23) 80.56,43.23 v1(84.7,47.38) ; v1(101.47,47.37) 96.77,42.67 ; 96.77,42.67 96.77,41.58 v1(89.92,34.72) 86.7,34.72 v1(85.5,33.53) 85.41,33.43 v1(85.41,31.62) 88.25,28.78 v1(89.92,28.78) 89.92,25.75 v1(88.94,24.77) ; 96.77,42.67 程序下载.1 93.85,47.38 ; v1(84.7,47.38) 93.85,47.38 ; v1(57.91,57.29) 57.27,56.64 v1(55.87,56.64) ; v1(57.91,57.29) 60.77,60.15 v1(60.77,63.63) ; 93.85,47.38 90.57,50.66 90.57,54.32
VIN: length 41.2
  电源层 w0.381: v1(99.58,29.02) 99.95,28.65 v1(99.95,24.8) 99.23,24.08 93.28,24.08 ; v1(91.91,24.64) 92.22,24.94 v1(92.22,28.78) ; v1(91.91,24.64) 90.77,23.49 86.81,23.49 v1(85.98,22.67) 83.95,20.64 83.95,13.84 SW1.2 ; v1(91.91,24.64) 92.73,24.64 93.28,24.08 ; 93.28,24.08 v1(93.28,21.72)
VIN1: length 6.6
  Top Layer w0.254: 电压输入1.1 12.18,55.97 电压输入开关1.3
VIN2: length 7.2
  Top Layer w0.254: 电压输入2.1 10.99,67.02 电压输入开关2.3
BOOT0: length 8.3
  Top Layer w0.254: BOOT.3 83.29,54.23 80.98,54.23 CH32V203C8T6.44
BOOT1: length 17.2
  Top Layer w0.254: CH32V203C8T6.20 76.5,47.62 v1(77.85,47.62)
  Bottom Layer w0.254: BOOT.5 86.34,56.12 v1(77.85,47.62)
IIN1: length 6.5
  电源层 w2: 电流输入1.1 11.54,28.92 电流输入开关1.3
IIN1-: length 24.2
  电源层 w2: 27.81,20.32 18.54,20.32 14.95,23.92 电流输入1.2
  vias: v1(27.58,20.95) v1(27.58,19.69)
IIN2: length 6.5
  电源层 w2: 电流输入2.1 11.75,14.56 11.84,14.48
IIN2-: length 22.9
  电源层 w2: 电流输入2.2 15.07,9.56 16.51,8.13 27.69,8.13
  vias: v1(27.58,8.76) v1(27.58,7.49)
NRST: length 10.1
  Top Layer w0.254: 复位.1 68.23,60.29 10K#13.2 70.51,58.01 100nF#6.1 71.62,56.17 CH32V203C8T6.7
PA0: length 27.4
  Top Layer w0.254: CH32V203C8T6.10 72.71,52.96 69.6,52.96 64.9,57.66 64.9,59.44 63,61.33 BAT54SLT1G.3 54.99,61.33 10k#3.1 54.11,60.45 TL084IDR.7
PA1: length 31.9
  Top Layer w0.254: 10k#5.1 46.01,52.71 TL084IDR.14 47.37,52.83 49.79,50.41 BAT54SLT1G#2.3 61.59,50.29 67.31,50.29 69.47,52.45 72.51,52.45 73.38,51.58
PA2: length 54.3
  Top Layer w0.254: CH32V203C8T6.12 72.31,51.94 69.72,51.94 63.11,45.33 BAT54SLT1G#3.3 47.5,45.33 42.42,50.42 36.2,50.42 30K#2.1 35.31,60.21 35.94,60.83 37.06,60.83 TL084IDR#2.7
PA3: length 61.4
  Top Layer w0.254: CH32V203C8T6.13 64.3,40.38 BAT54SLT1G#4.3 50.05,40.38 40.89,49.53 35.43,49.53 34.04,50.93 34.04,59.69 32.89,60.83 31.77,60.83 TL084IDR#2.8 30.23,60.96 29.6,61.59 30K#4.1
PB3: length 31.8
  Top Layer w0.254: CH32V203C8T6.39 78.49,48.2 v1(78.49,46.74)
  Bottom Layer w0.254: OLED.4 78.49,40.77 v1(78.49,46.74)
PB4: length 33.5
  Top Layer w0.254: CH32V203C8T6.40 78.22,48.64 v1(77.47,48.64)
  Bottom Layer w0.254: OLED.3 62.48,33.66 v1(77.47,48.64)
PB6: length 38.3
  Top Layer w0.254: CH32V203C8T6.42 81.28,52.99 81.78,53.49 85.01,53.49 91.31,47.18 v1(91.31,44.32) ; 10K#5.2 107.07,36.83 98.81,36.83 v1(93.22,42.42)
  Bottom Layer w0.254: v1(91.31,44.32) v1(93.22,42.42)
PB7: length 43.5
  Top Layer w0.254: v1(92.2,44.83) 92.2,46.8 85.15,53.84 81.3,53.84 CH32V203C8T6.43 ; 10K#4.1 113.03,35.69 111.25,37.46 99.57,37.46 v1(94.62,42.42)
  Bottom Layer w0.254: v1(92.2,44.83) v1(94.62,42.42)
PB8: length 40.6
  Top Layer w0.254: CH32V203C8T6.45 80.22,54.05 80.75,54.58 82.05,54.58 88.31,60.84 89.24,60.84 89.24,60.83 93.34,60.83 v1(103.31,50.86)
  Bottom Layer w0.254: v1(103.31,50.86) 106.55,47.62 106.55,45.22 v1(108.97,42.8)
PB9: length 43.6
  Top Layer w0.254: v1(108.71,51.05) 96.65,63.12 86.61,63.12 82.93,59.44 82.93,57.53 79.81,54.41 CH32V203C8T6.46
  Bottom Layer w0.254: v1(108.71,51.05) 111.76,48.01 v1(112.36,48.01)
PC14: length 14.5
  Top Layer w0.254: CH32V203C8T6.3 74.8,55.81 74.8,59.63 12pF.2 79.18,66.14 32.768MHZ.2
PC15: length 14.3
  Top Layer w0.254: 32.768MHZ.1 77.31,64.03 12pF#2.2 74.29,61.02 74.29,55.62 CH32V203C8T6.4
PD0: length 20.5
  Top Layer w0.254: 8MHZ.2 65.83,67.62 73.41,60.05 73.41,55.09 CH32V203C8T6.6
PD1: length 20.9
  Top Layer w0.254: 8MHZ.1 66.88,69.17 20pF.2 69.35,64.6 73.76,60.19 73.76,60.1 73.79,60.07 73.79,55.42 CH32V203C8T6.5
PWM_OUT1: length 20.5
  Top Layer w0.254: v1(112.76,45.21) 112.63,45.08 111.25,45.08 110.87,45.47 5.1K.2
  Bottom Layer w0.254: 5VPWM输出1.1 115.1,46.65 113.66,45.21 v1(112.76,45.21)
PWM_OUT2: length 16.8
  Top Layer w0.254: RS8452XK.7 120.15,43.94 v1(120.28,44.07)
  Bottom Layer w0.254: v1(120.28,44.07) 130.17,34.17 5VPWM输出2.1
PWM_OUT3: length 12.2
  Top Layer w0.254: 24VPWM输出1.1 130.02,22.27 62K.2 123.2,29.08 RS8452XK#2.1
PWM_OUT4: length 28.3
  Top Layer w0.254: 62K#2.1 115.31,30.23 RS8452XK#2.7 116.08,30.35 122.81,23.62 122.81,18.33 24VPWM输出2.1
RS485A: length 27.3
  Top Layer w0.254: v1(116.71,67.6) 116.71,68.33 119.13,70.74 4.7KΩ#2.2 119.63,70.74 120.4,71.5 120.4,73.52 120Ω.1
  Bottom Layer w0.254: RS485上位机接口.1 125.78,57.74 116.71,66.8 v1(116.71,67.6)
RS485B: length 25.2
  Top Layer w0.254: RS485上位机接口.2 119.38,62.74 115.44,66.67 MAX485ESA+T.7 115.44,68.33 116.59,69.47 116.59,71.49 4.7KΩ#3.1 120Ω.2
SWCLK: length 14.2
  Top Layer w0.254: CH32V203C8T6.37 83.77,52.07 v1(85.6,52.07)
  Bottom Layer w0.254: v1(85.6,52.07) 程序下载.4
SWDIO: length 17.5
  Top Layer w0.254: v1(83.31,47.37) 83.25,47.37 CH32V203C8T6.34
  Bottom Layer w0.254: 程序下载.3 92.71,45.47 85.22,45.47 v1(83.31,47.37)
UARTRX: length 41.6
  Top Layer w0.254: 4.7KΩ.1 114.04,62.06 MAX485ESA+T.1 ; 80.81,46.98 80.14,47.65 v1(80.14,48.64)
  Bottom Layer w0.254: v1(80.14,48.64) 81.91,50.42 81.91,50.55 82.09,50.73 101.4,50.73 v1(112.65,61.98)
UARTTX: length 40.1
  Top Layer w0.254: 4.7KΩ#4.2 110.88,49.78 105.16,49.78 98.55,43.18 85.32,43.18 CH32V203C8T6.31
$1N657: length 5.1
  Top Layer w0.381: 0Ω.2 72.29,54.08 ; 72.29,54.08 74.08,52.29 CH32V203C8T6.9 ; 72.29,54.08 100nF#2.2
$1N671: length 2.4
  Top Layer w0.381: CH32V203C8T6.1 76.7,55.33 100nF.2
$1N1522: length 2.3
  Top Layer w0.254: S9013.1 116.7,54.09 4.7KΩ#4.1
$1N1526: length 10.7
  Top Layer w0.254: 4.7KΩ#5.1 114.69,57.16 S9013.3 114.7,57.29 115.44,58.04 115.44,59.32 ; MAX485ESA+T.3 116.71,60.59 115.44,59.32 ; 115.44,59.32 MAX485ESA+T.2
$1N2736: length 6.5
  电源层 w0.381: 供电.1 86.43,5.36 SW1.1
$1N3426: length 1.8
  Top Layer w0.254: 330Ω.2 83.91,33.57 3.3V电源灯.2
$1N3897: length 1.8
  Top Layer w0.254: 470Ω.2 103.37,35.55 5V电源灯.2
$1N5125: length 6.1
  Top Layer w0.254: 10KΩ.2 5.1K.1 110.5,43.94 RS8452XK.2
$1N5128: length 2.3
  Top Layer w0.254: 10K.2 112.63,42.8 RS8452XK.3
$1N5140: length 7.2
  Top Layer w0.254: 120.39,42.67 5.1K#2.2 ; 120.39,42.67 RS8452XK.6 ; 120.39,42.67 123.2,42.67 10K#3.2
$1N5275: length 8.8
  Top Layer w0.254: RS8452XK.5 117.35,41.4 115.57,43.18 115.57,46.35 10K#2.1
$1N6201: length 6.5
  Top Layer w0.254: SS34.1 105.73,19.77 4.7uH.1 105.73,24.26 MT3608.1
$1N6386: length 4.2
  Top Layer w0.254: 390KΩ.1 10KΩ#2.2 107.49,26.86 MT3608.3
$1N7527: length 5
  Top Layer w0.254: RS8452XK#2.2 121.78,30.35 ; 121.78,30.35 10KΩ#3.2 ; 121.78,30.35 123.44,30.35 62K.1
$1N7530: length 6.3
  Top Layer w0.254: 10K#4.2 118.87,33.77 118.87,32.38 119.63,31.62 120.79,31.62
$1N7544: length 4.5
  Top Layer w0.254: 115.43,31.62 115.31,31.74 62K#2.2 112.89,31.88 10K#6.2
$1N7545: length 4.9
  Top Layer w0.254: RS8452XK#2.5 115.3,33.02 112.65,33.02 111.38,34.29 10K#5.1
$1N7868: length 11
  Top Layer w0.254: 111.04,26.52 10uF#6.2 ; 111.04,26.52 10uF#7.2 磁珠.1 ; 111.04,26.52 113.6,29.08 RS8452XK#2.8
$1N9305: length 6.4
  Top Layer w0.254: TL084IDR.3 53.09,55.37 20K#2.2 56.13,58.41 10K#7.1
$1N9307: length 4.9
  Top Layer w0.254: 20K.2 10K#8.2 54.47,54.1 TL084IDR.2
$1N9531: length 2.7
  Top Layer w0.254: 采样3.3V供电.2 60.42,58.79 330Ω#2.1
$1N9532: length 2.3
  Top Layer w0.254: 470Ω#2.1 采样5V供电.2
$1N9631: length 2.9
  Top Layer w0.254: 470Ω#3.1 110.96,15.42 PWM区供电.2
$1N10550: length 8.9
  Top Layer w0.254: 电压输入开关1.2 19.18,56.13 22.48,52.83 24.64,52.83
$1N10551: length 7.3
  Top Layer w0.254: 18.2K.1 28.33,52.83 110K.2 26.66,55.39 10K#9.1
$1N10553: length 24.5
  Top Layer w0.254: 10k.2 39.76,54.61 37.85,54.61 ; 37.85,54.61 38.73,55.5 38.73,64.02 10K#10.1 ; 37.85,54.61 v1(37.19,54.61)
  Bottom Layer w0.254: v1(31.91,50.8) 31.99,50.72 37.06,50.72 37.41,51.07 37.41,51.75 37.19,51.97 v1(37.19,54.61)
$1N10555: length 9.1
  Top Layer w0.254: 10k#2.2 43.18,50.67 40.63,53.22 10k.1 39.76,53.34 TL084IDR#2.1
$1N10556: length 13.2
  Top Layer w0.254: v1(51.66,59.18) 54.11,59.18 10k#3.2
  Bottom Layer w0.254: v1(46.77,50.67) 49.91,53.81 49.91,57.43 v1(51.66,59.18)
$1N10559: length 13.2
  Top Layer w0.254: 电压输入开关2.2 18.92,63.88 26.92,63.88 110K#2.1
$1N10560: length 4
  Top Layer w0.254: 18.2K#2.1 32.87,67.41 10K#11.1 30.85,67.43 110K#2.2
$1N10562: length 16.1
  Top Layer w0.254: 10K#12.1 34.78,65.92 18.2K#2.2 ; v1(43.81,59.06) 46.01,59.06 TL084IDR.9
  Bottom Layer w0.254: v1(34.79,65.89) 34.95,65.89 41.78,59.05 43.81,59.05 v1(43.81,59.06)
$1N10563: length 7.3
  Top Layer w0.254: 10k#4.2 42.42,60.57 10k#6.1 46.01,60.57 TL084IDR.8
$1N10564: length 7.3
  Top Layer w0.254: 10k#4.1 41.51,56.52 10k#5.2 46.01,54.22 TL084IDR.13
$1N11472: length 14
  电源层 w2: 电流输入开关1.2 22.48,22.86 27.81,22.86
  vias: v1(27.58,23.49) v1(27.58,22.22)
$1N11473: length 3
  Top Layer w0.254: ACS723LLCTR1.6 1nF.2
$1N11480: length 12.4
  电源层 w2: 电流输入开关2.2 20.45,10.67 27.43,10.67
  vias: v1(27.58,11.3) v1(27.58,10.03)
$1N11481: length 3.9
  Top Layer w0.254: ACS723LLCTR2.6 36.64,8.76 1nF#2.2
$1N11486: length 28.8
  Top Layer w0.254: 50K#2.1 30.86,45.47 30.86,23.37 32,22.22 ACS723LLCTR1.7
$1N11487: length 24
  Top Layer w0.254: v1(36.82,51.31) v1(38.49,51.31)
  Bottom Layer w0.254: v1(36.82,51.31) 35.69,52.44 35.69,58.8 36.58,59.69 v1(37.19,59.69) 39.37,59.69 41.27,57.78 41.27,54.1 38.48,51.31
$1N11488: length 15.2
  Top Layer w0.254: 50K#2.2 34.92,48.51 30K.2
  Bottom Layer w0.254: v1(33.66,49.82) 33.69,49.82 33.97,50.1 37.02,50.1 37.91,50.99 37.91,57.7 v1(37.19,58.42)
$1N11493: length 43.1
  Top Layer w0.254: ACS723LLCTR2.7 32.26,10.03 29.46,12.83 29.46,50.03 50K#4.1
$1N11494: length 5.4
  Top Layer w0.254: TL084IDR#2.9 30.23,59.69 29.84,60.08 30K#4.2 50K#3.2
$1N11495: length 10.8
  Top Layer w0.254: TL084IDR#2.10 31.52,58.29 v1(29.2,58.29)
  Bottom Layer w0.254: v1(29.2,58.29) 27.19,56.28 v1(27.19,50.8)

## Copper pours and planes (outline as drawn; the poured copper is in the pictures)
AGND on Top Layer: -0.13,78.61 58.93,78.61 59.06,78.49 59.06,64.64 64.52,64.64 64.52,34.04 45.47,34.04 45.47,0 0.51,0 0,0.51 0,3.11 -0.13,3.24
AGND on Bottom Layer: 0,78.49 58.97,78.49 58.97,64.52 64.39,64.52 64.39,34.16 45.34,34.16 45.34,0 0,0
AGND on 电源层: -0.13,78.61 58.95,78.61 58.95,78.59 59.06,78.49 59.06,64.64 64.52,64.64 64.52,34.04 45.47,34.04 45.47,0 0.51,0 0,0.51 0,78.49
AGND on GND: 0,78.49 58.97,78.49 58.97,64.52 64.39,64.52 64.39,34.16 45.34,34.16 45.34,0 0,0
GND on Top Layer: 42.93,88.26 152.78,88.26 152.78,-23.37 42.93,-23.37
GND on Bottom Layer: 43.31,79.63 136.78,79.63 136.78,-2.16 43.31,-2.16
GND on 电源层: 42.8,81.28 141.22,81.28 141.22,-6.35 42.8,-6.35
GND on GND: 43.05,83.44 142.49,83.44 142.49,-5.33 43.05,-5.33

## Text on the board
Top Silkscreen Layer: 基于CH32的多路电压电流监测 / 与智能控制系统 | ModBus RS485 / 通讯串口
